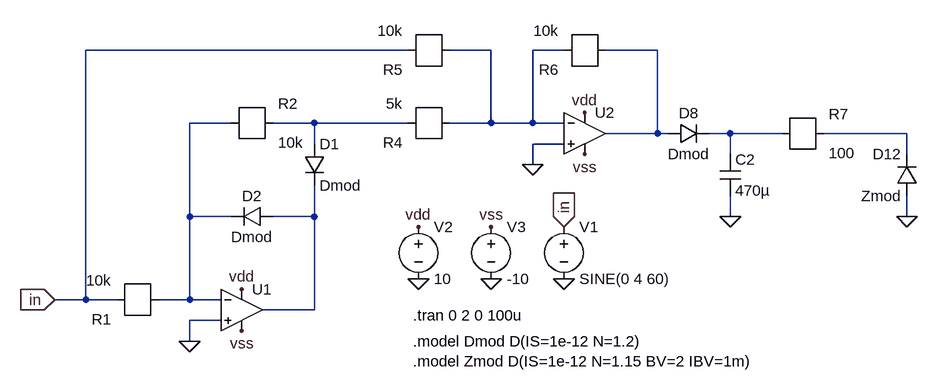
[diagram p0: schematic circuit_a_lt.asc]
circuit_a_lt.asc, the LTspice schematic file:
Version 4
SHEET 1 2116 1016
WIRE 832 -16 336 -16
WIRE 960 -16 896 -16
WIRE 1072 -16 1024 -16
WIRE 1216 -16 1136 -16
WIRE 560 96 496 96
WIRE 688 96 624 96
WIRE 832 96 688 96
WIRE 960 96 960 -16
WIRE 960 96 896 96
WIRE 1024 96 1024 -16
WIRE 1024 96 960 96
WIRE 1072 96 1024 96
WIRE 1216 112 1216 -16
WIRE 1216 112 1136 112
WIRE 1232 112 1216 112
WIRE 1328 112 1296 112
WIRE 1408 112 1328 112
WIRE 1600 112 1472 112
WIRE 688 128 688 96
WIRE 1072 128 1024 128
WIRE 1328 144 1328 112
WIRE 1600 144 1600 112
WIRE 1024 160 1024 128
WIRE 496 240 496 96
WIRE 560 240 496 240
WIRE 688 240 688 192
WIRE 688 240 624 240
WIRE 1328 240 1328 208
WIRE 1600 240 1600 208
WIRE 336 368 336 -16
WIRE 336 368 288 368
WIRE 384 368 336 368
WIRE 496 368 496 240
WIRE 496 368 448 368
WIRE 544 368 496 368
WIRE 688 384 688 240
WIRE 688 384 608 384
WIRE 544 400 496 400
WIRE 496 432 496 400
FLAG 960 336 0
FLAG 848 336 0
FLAG 848 256 vdd
FLAG 960 256 vss
FLAG 1072 336 0
FLAG 496 432 0
FLAG 1024 160 0
FLAG 576 416 vss
FLAG 1104 144 vss
FLAG 576 352 vdd
FLAG 1104 80 vdd
FLAG 288 368 in
IOPIN 288 368 In
FLAG 1072 256 in
IOPIN 1072 256 In
FLAG 1328 240 0
FLAG 1600 240 0
SYMBOL voltage 1072 240 R0
SYMATTR InstName V1
SYMATTR Value SINE(0 4 60)
SYMBOL voltage 848 240 R0
SYMATTR InstName V2
SYMATTR Value 10
SYMBOL diode 672 128 R0
SYMATTR InstName D1
SYMATTR Value Dmod
SYMBOL voltage 960 240 R0
SYMATTR InstName V3
SYMATTR Value -10
SYMBOL r 448 368 R180
SYMATTR InstName R1
SYMATTR Value 10k
SYMBOL r 560 96 R0
SYMATTR InstName R2
SYMATTR Value 10k
SYMBOL diode 624 224 R90
WINDOW 0 0 32 VBottom 2
WINDOW 3 32 32 VTop 2
SYMATTR InstName D2
SYMATTR Value Dmod
SYMBOL r 896 96 R180
SYMATTR InstName R4
SYMATTR Value 5k
SYMBOL r 896 -16 R180
SYMATTR InstName R5
SYMATTR Value 10k
SYMBOL r 1136 -16 R180
SYMATTR InstName R6
SYMATTR Value 10k
SYMBOL Opamps/UniversalOpAmp 576 384 R0
SYMATTR InstName U1
SYMBOL cap 1312 144 R0
SYMATTR InstName C2
SYMATTR Value 470µ
SYMBOL r 1408 112 R0
SYMATTR InstName R7
SYMATTR Value 100
SYMBOL diode 1616 208 R180
WINDOW 0 24 64 Left 2
WINDOW 3 24 0 Left 2
SYMATTR InstName D12
SYMATTR Value Zmod
SYMBOL Opamps/UniversalOpAmp 1104 112 R0
SYMATTR InstName U2
SYMBOL diode 1232 128 R270
WINDOW 0 32 32 VTop 2
WINDOW 3 0 32 VBottom 2
SYMATTR InstName D8
SYMATTR Value Dmod
TEXT 840 392 Left 2 !.tran 0 2 0 100u
TEXT 840 432 Left 2 !.model Dmod D(IS=1e-12 N=1.2)\n.model Zmod D(IS=1e-12 N=1.15 BV=2 IBV=1m)

The netlist it stands for:
* circuit_a_lt.asc
V1 in 0 SINE(0 4 60)
V2 vdd 0 10
D1 N004 N007 Dmod
V3 vss 0 -10
R1 in N003 10k
R2 N004 N003 10k
D2 N007 N003 Dmod
R4 N004 N001 5k
R5 in N001 10k
R6 N001 N002 10k
XU1 0 N003 vdd vss N007 level1 Avol=1Meg GBW=10Meg Vos=0 En=0 Enk=0 In=0 Ink=0 Rin=500Meg  ; pins In+ In- V+ V- OUT
C2 N005 0 470µ
R7 N006 N005 100
D12 0 N006 Zmod
XU2 0 N001 vdd vss N002 level1 Avol=1Meg GBW=10Meg Vos=0 En=0 Enk=0 In=0 Ink=0 Rin=500Meg  ; pins In+ In- V+ V- OUT
D8 N002 N005 Dmod
.model D D
.lib standard.dio
.tran 0 2 0 100u
.model Dmod D(IS=1e-12 N=1.2)
.model Zmod D(IS=1e-12 N=1.15 BV=2 IBV=1m)
.lib UniversalOpAmp1.lib
.backanno
.end